# Altium schematic sheet iSystem-battery_charger.SchDoc
size 420 x 297 mm; SheetNumber: 2; SheetTotal: 8
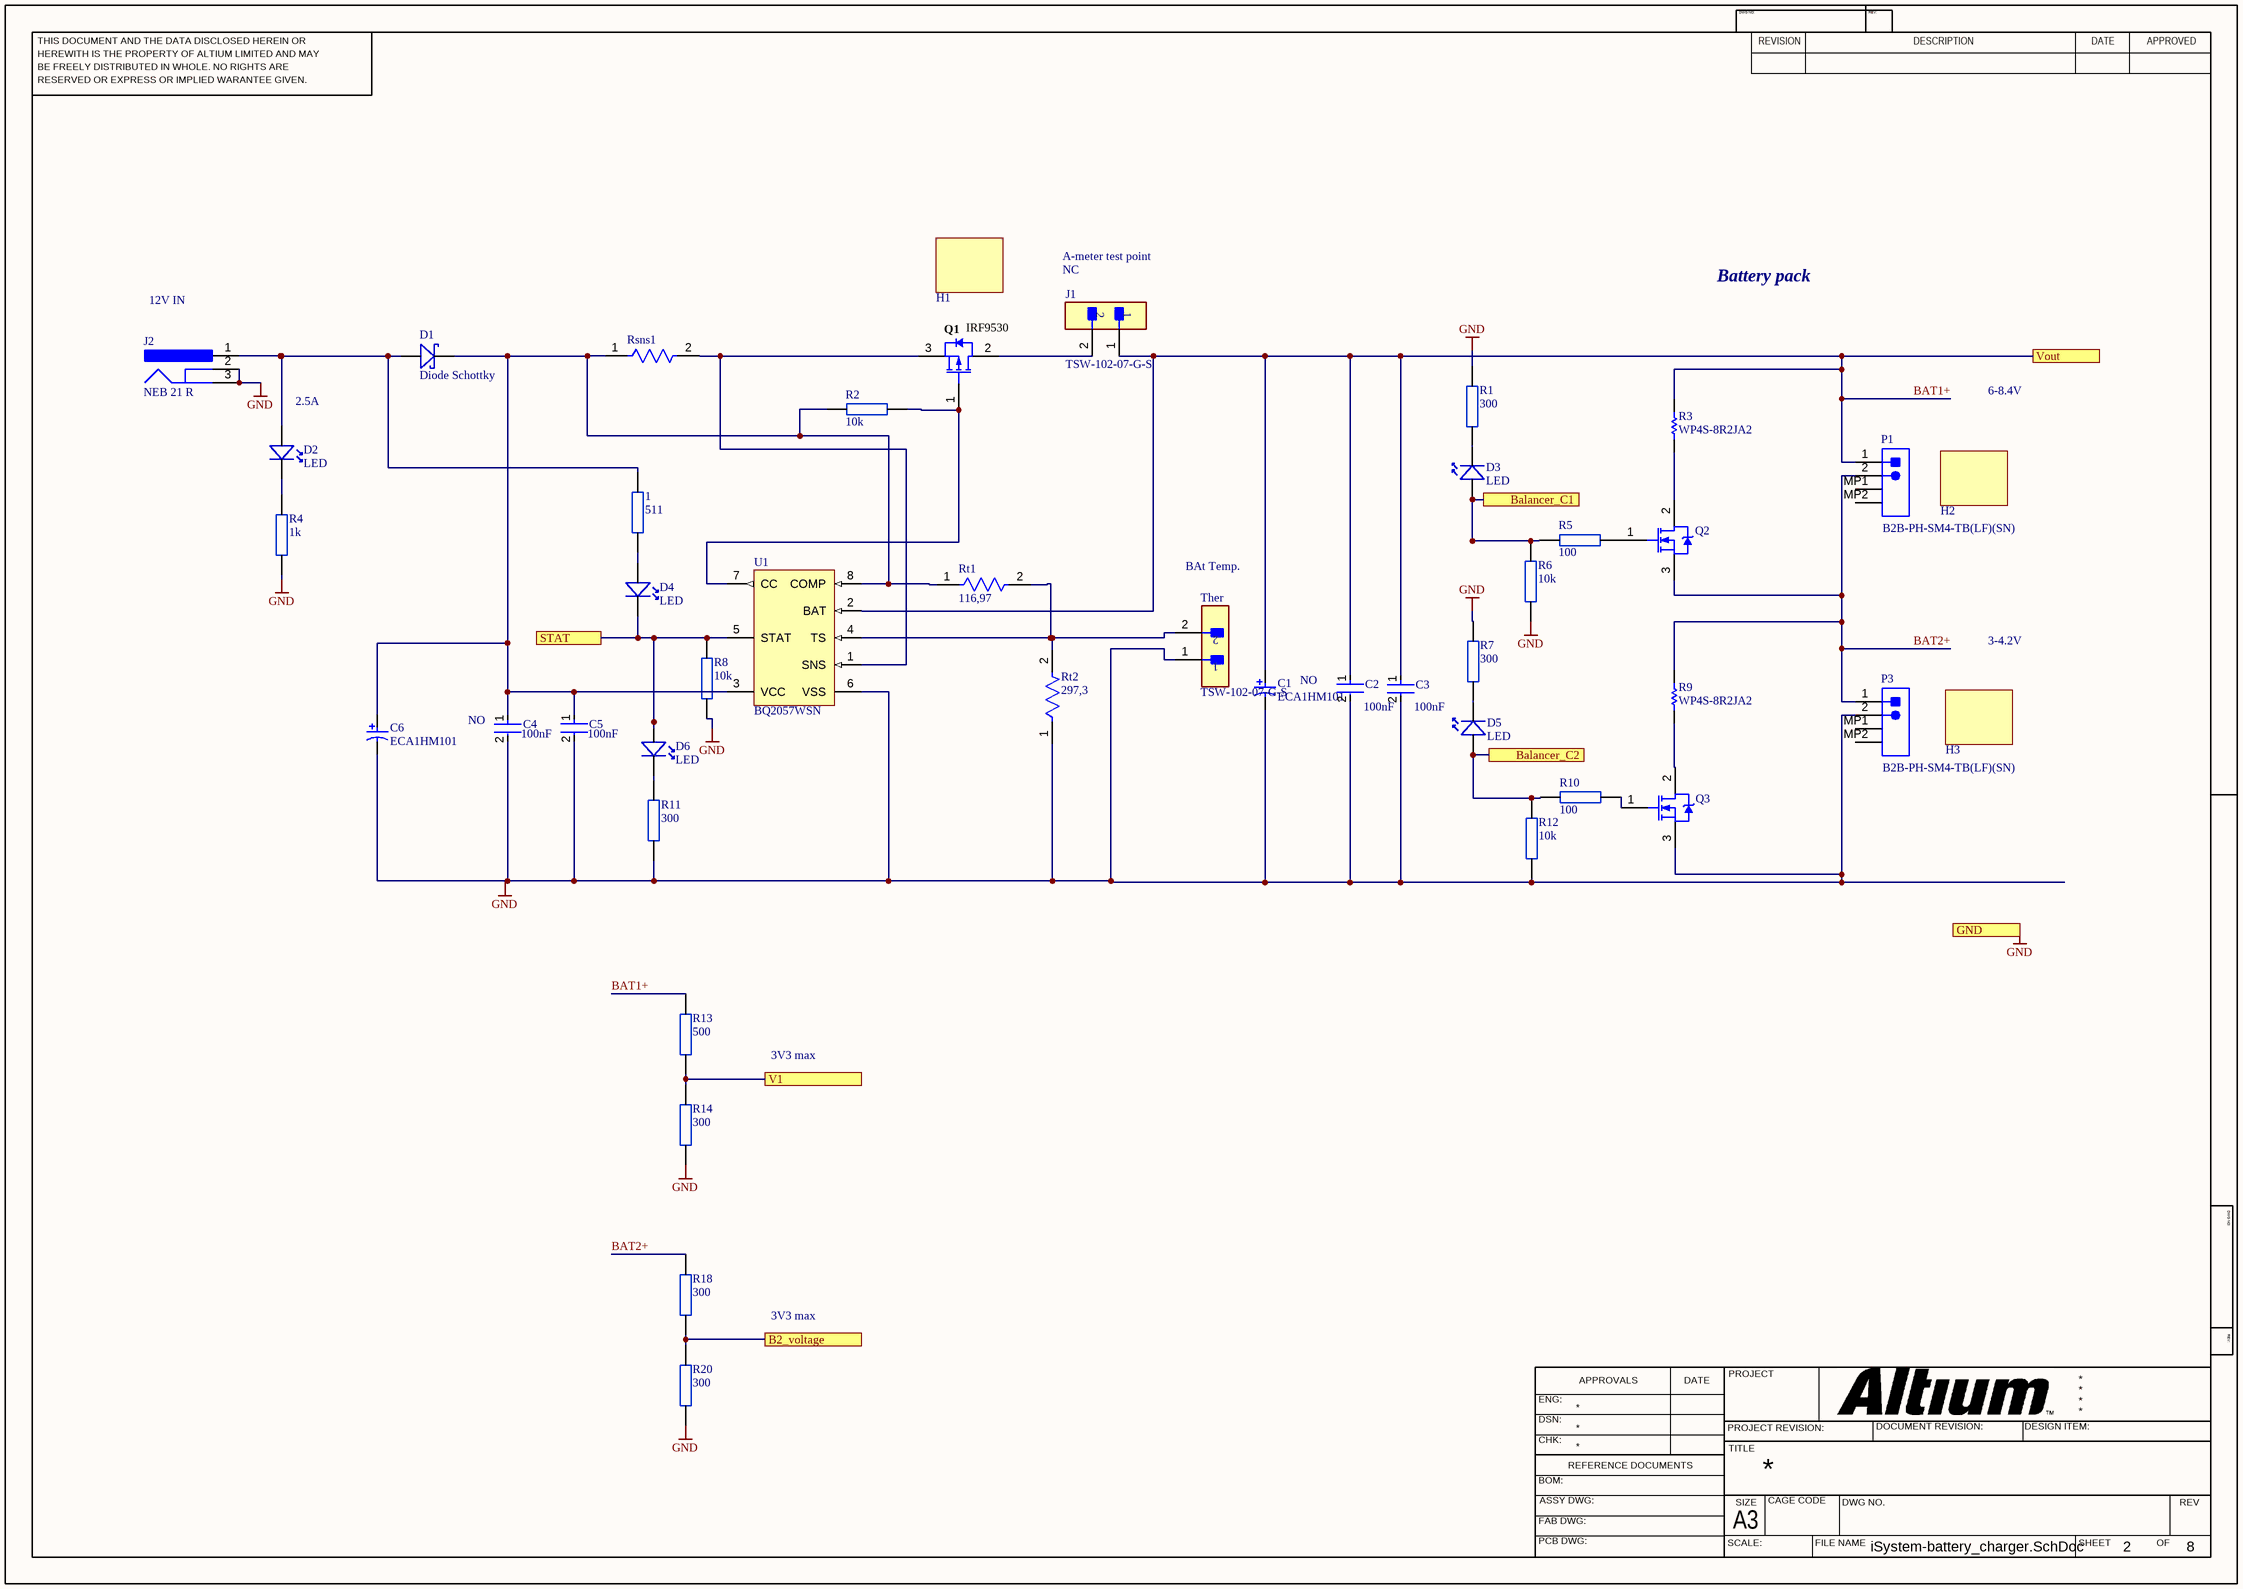
[diagram p0: iSystem-battery_charger.SchDoc]

## Parts
1  511  [0603]
C1  ECA1HM101  [CAPPR65-350-1150X800X1250]
C2  100nF  [FP-CGA3E-0_3-0_1-IPC_A]
C3  100nF  [FP-CGA3E-0_3-0_1-IPC_A]
C4  100nF  [FP-CGA3E-0_3-0_1-IPC_A]
C5  100nF  [FP-CGA3E-0_3-0_1-IPC_A]
C6  ECA1HM101  [CAPPR65-350-1150X800X1250]
D1  Diode Schottky  [DO-214AC SMA]
D2  LED  [0805 LED RED]
D3  LED  [0805 LED RED]
D4  LED  [0805 LED RED]
D5  LED  [0805 LED RED]
D6  LED  [0805 LED RED]
H1  TO-220AB heatsink  [TO-220AB heatsink]  (value not drawn)
H2  TO-220AB heatsink  [TO-220AB heatsink]  (value not drawn)
H3  TO-220AB heatsink  [TO-220AB heatsink]  (value not drawn)
J1  TSW-102-07-G-S  [FP-TSW-102-07-G-S-MFG]
J2  NEB 21 R  [LUMB-NEB21R_V]
P1  B2B-PH-SM4-TB(LF)(SN)  [JST-B2B-PH-SM4-TB-2_V]
P3  B2B-PH-SM4-TB(LF)(SN)  [JST-B2B-PH-SM4-TB-2_V]
Q1  IRF9530  [FAIR-TO-220-3]
Q2  IRFB31N20DPBF  [INTR-TO-220AB-3]  (value not drawn)
Q3  IRFB31N20DPBF  [INTR-TO-220AB-3]  (value not drawn)
R1  300  [0603]
R2  10k  [0603]
R3  WP4S-8R2JA2  [VISH-A1-2_V2]
R4  1k  [0603]
R5  100  [0603]
R6  10k  [0603]
R7  300  [0603]
R8  10k  [0603]
R9  WP4S-8R2JA2  [VISH-A1-2_V2]
R10  100  [0603]
R11  300  [0603]
R12  10k  [0603]
R13  500  [0603]
R14  300  [0603]
R18  300  [0603]
R20  300  [0603]
Rsns1  CRCW12060000Z0EA  [FP-CRCW1206-e3-IPC_C]  (value not drawn)
Rt1  116,97  [FP-CRCW1206-e3-IPC_C]
Rt2  297,3  [FP-CRCW1206-e3-IPC_C]
Ther  TSW-102-07-G-S  [FP-TSW-102-07-G-S-MFG]
U1  BQ2057WSN  [D0008A_N]

## Ports
B2_voltage, Balancer_C1, Balancer_C2, GND, STAT, V1, Vout

## Nets
GND: C1.2 C2.2 C3.2 C4.2 C5.2 C6.2 J2.2 J2.3 P3.2 Q3.3(S) R1.1 R4.1 R6.2 R7.1 R8.1 R11.1 R12.2 R14.1 R20.1 Rt2.1 Ther.1 U1.6(VSS) ; port GND
B2_voltage: R18.1 R20.2 ; port B2_voltage
Balancer_C1: D3.1(A) R5.2 R6.1 ; port Balancer_C1
Balancer_C2: D5.1(A) R10.2 R12.1 ; port Balancer_C2
BAT1+: C1.1 C2.1 C3.1 J1.1 P1.1 R3.2 R13.2 U1.2(BAT) ; port Vout
BAT2+: P1.2 P3.1 Q2.3(S) R9.2 R18.2
STAT: D4.2(K) D6.1(A) R8.2 U1.5(STAT) ; port STAT
V1: R13.1 R14.2 ; port V1
Net1_1: 1.1 D4.1(A)
Net1_2: 1.2 D1.1(A) D2.1(A) J2.1
NetC4_1: C4.1 C5.1 C6.1 D1.2(K) R2.2 Rsns1.1 Rt1.1 U1.3(VCC) U1.8(COMP)
NetD2_2: D2.2(K) R4.2
NetD3_2: D3.2(K) R1.2
NetD5_2: D5.2(K) R7.2
NetD6_2: D6.2(K) R11.2
NetJ1_2: J1.2 Q1.2(D)
NetQ1_1: Q1.1(G) R2.1 U1.7(CC)
NetQ1_3: Q1.3(S) Rsns1.2 U1.1(SNS)
NetQ2_1: Q2.1(G) R5.1
NetQ2_2: Q2.2(D) R3.1
NetQ3_1: Q3.1(G) R10.1
NetQ3_2: Q3.2(D) R9.1
NetRt1_2: Rt1.2 Rt2.2 Ther.2 U1.4(TS)

Not connected (* = marked no-connect by the designer): P1 MP1 MP2; P3 MP1 MP2

## Notes on the sheet
- A-meter test point
- 12V IN
- NC
- Battery pack
- 6-8.4V
- (near D2) 2.5A
- BAt Temp.
- 3-4.2V
- (near C4) NO
- NO
- 3V3 max
- THIS DOCUMENT AND THE DATA DISCLOSED HEREIN OR
- HEREWITH IS THE PROPERTY OF ALTIUM LIMITED AND MAY
- DWG NO:
- REVISION
- REV:
- DESCRIPTION
- DATE
- APPROVED
- BE FREELY DISTRIBUTED IN WHOLE. NO RIGHTS ARE
- RESERVED OR EXPRESS OR IMPLIED WARANTEE GIVEN.
- ENG:
- APPROVALS
- PROJECT
- DSN:
- CHK:
- REFERENCE DOCUMENTS
- PROJECT REVISION:
- TITLE
- DOCUMENT REVISION:
- DESIGN ITEM:
- BOM:
- FAB DWG:
- PCB DWG:
- ASSY DWG:
- SCALE:
- A3
- SIZE
- CAGE CODE
- FILE NAME
- DWG NO.
- SHEET
- OF
- REV

## Library data of the parts
1 R1 R2 R4-R8 R10-R14 R18 R20 = Resistor: Value: ?
C1 C6 = CMP-1665-00042-2: Aluminum Electrolytic Capacitor, 100 uF, +/- 20%, 50 V, -40 to 85 degC, 2-Pin THD, RoHS, Bulk; Manufacturer: Panasonic; Lead Diameter: 0.6mm; Dielectric Material: Aluminium; Voltage Rating (DC): 50V; Ripple Current (AC): 250mA; Polarity: Polar; Leakage Current: 3uA; Capacitance: 100uF; Life (Hours): 2000Hour; Lead/Base Style: Straight; Dissipation Factor: 0.12%; Radiation Hardening: No; Height: 11.5mm; Package Quantity: 200; Package Reference: CAPPR65-350-1150X800X1250; Min Operating Temperature: -40degC; Mount: ThroughHole; Package Description: 2-Pin Radial Lead, Dia 8 mm, Height 12.5 mm; Case/Package: Radial; Diameter: 8mm; Voltage Rating: 50V; Length: 11.5mm; REACH SVHC: NoSVHC; Height - Seated (Max): 0.492inch; Datasheet URL: https://industrial.panasonic.com/cdbs/www-data/pdf/RDF0000/ABA0000C1218.pdf; RoHSCompliant: true; Ripple Current: 250mA; Lead Free: LeadFree; Voltage: 50V; Manufacturer URL: http://www.panasonic.com/; Number of Pins: 2; Datasheet Version: Rev. 05, 10/2016; Packaging: Bulk; Termination: Radial; Max Operating Temperature: 85degC; Tolerance: 20%; Lead Pitch: 3.5mm
C2-C5 = CMP-2000-07546-2: Cap Ceramic 100nF 50V X7R 10% Pad SMD 0603 +125°C Automotive T/R; Weight: 7.1E-05oz; Composition: Ceramic; Max Operating Temperature: 125°C; Termination: SMD/SMT; Dielectric: X7R; Length: 1.6mm; Package Quantity: 1; REACH SVHC: No SVHC; Lead Free: Lead Free; Case Code (Metric): 1608; Min Operating Temperature: -55°C; Packaging: Tape and Reel; Tolerance: 10%; Voltage Rating: 50V; Case Code (Imperial): 0603; Capacitance: 100nF; Case/Package: 0603; Voltage Rating (DC): 50V; Depth: 0.8mm; Radiation Hardening: No; Ratings: AEC-Q200; Mount: Surface Mount; Voltage: 50V; Thickness: 0.035inch; Width: 0.8mm; Height: 0.8mm
J1 Ther = CMP-02766-000084-1: CONN HEADER VERT 2POS 2.54MM; Manufacturer: Samtec; Number Of Contacts: 2; Voltage Rating: 550V; Conn Orientation: Straight; Current Rating: 6.3A; Conn Gender: Male; Package: TSW-102-07-G-S; Digikey Description: CONN HEADER VERT 2POS 2.54MM; ComponentLink2URL: http://suddendocs.samtec.com/catalog_english/tsw_th.pdf; Height: 8.71mm; Temperature: -55°C to +125°C; Device Class L2: Headers and Wire Housings; ComponentLink2Description: Datasheet; Device Class L3: unset; Contact Material: Gold,Nickel; Temperature Range Low: -55°C; Temperature Range High: +125°C; RoHS: TRUE; Device Class L1: Connectors; Mouser Description: Conn Unshrouded Header HDR 2 POS 2.54mm Solder ST Thru-Hole Automotive Bulk; Number Of Rows: 1; Category: Conn; Pitch: 2.54mm; Lead Free: Yes; Automotive: No; Manufacturer Part Number: TSW-102-07-G-S; Footprint Url: http://suddendocs.samtec.com/prints/tsw-xxx-xx-x-x-xx-xxx-footprint.pdf; Octopart: https://octopart.com/tsw-102-07-g-s-samtec-272197
J2 = CMP-2000-06841-1: Jack Socket, Body 14.5 x 9 mm, Height 11 mm, -20 to 70 degC, 3-Pin THD, RoHS, Bulk; Manufacturer: Lumberg; Body Orientation: RightAngle; Voltage Rating: 12Vdc; Current Rating: 3A; Maximum Operating Temperature: +70°C; Mounting Technology: ThroughHole; Termination Method: Solder; Package Description: 3-Pin Through Hole Device, Body 14.5 x 9 mm, Height 11 mm; Datasheet URL: https://datasheet.ciiva.com/11720/0900766b805694d6-11720273.pdf; Datasheet Version: 12/2004; Package Reference: NEB21R; Manufacturer URL: http://www.lumberg.com/; Plug/Socket: Socket; Mounting Type: ThroughHole; Minimum Operating Temperature: -20°C
P1 P3 = CMP-2000-05163-1: Male Header, Pitch 2 mm, 1 x 2 Position, Height 6.6 mm, RoHS, Tape and Reel; Manufacturer: JST; No of Positions: 2; Style/Orientation: StraightHeader/Plug; Pitch: 2mm; Datasheet URL: https://ciiva.com/datasheet-click-26894756?src=ciiva&sig=90099765; Termination: Crimp; Manufacturer URL: http://www.jst.com/home2.html; Type: ShroudedHeader; Datasheet Version: Dec-12
Q1 = CMP-2000-04936-1: P-Channel QFET(R) MOSFET, -60 V, -27 A, -55 to 175 degC, 3-Pin TO-220, RoHS, Tube; Manufacturer: Fairchild; Rated Power Dissipation: 120W; Qg Gate Charge: 33nC; Drain-Source On Resistance-Max: 0.07O; Drain-to-Source Voltage [Vdss]: 60V; Package Reference: TO-220; Datasheet URL: https://www.fairchildsemi.com/datasheets/FQ/FQP27P06.pdf; Datasheet Version: Mar-13; Package Description: 3-Pin Through Hole Device, Body 10 x 4.5 mm, Pitch 2.54 mm; Package URL: https://www.fairchildsemi.com/package-drawings/TO/TO220B03.pdf; Channel Type: P-Channel; Manufacturer URL: https://www.fairchildsemi.com/
Q2 Q3 = CMP-2000-06468-1: HEXFET(R) Power MOSFET, 200 V, 31 A, 82 mOhm, -55 to 175 degC, 3-Pin FM (TO-220AB), RoHS, Tube; Manufacturer: International Rectifier; Temperature, Operating, Maximum: +175°C; Channel Mode: Enhancement; Power Dissipation: 200W; Time, Turn-Off Delay: 26ns; Voltage, Gate to Source: ±30V; Capacitance, Input: 2370pF@25V; Gate Charge, Total: 70nC; Brand/Series: HEXFET®Series; Voltage, Diode Forward: 1.3V; Polarization: N-Channel; Transconductance, Forward: 17S; Resistance, Thermal, Junction to Case: 0.75°C/W; Current, Drain: 31A; Time, Turn-On Delay: 16ns; Configuration: DualDrain; Resistance, Drain to Source On: 0.082Ω; Channel Type: N; Temperature, Operating, Minimum: -55°C; Number of Elements per Chip: 1; Temperature, Operating, Range: -55to+175°C; Voltage, Drain to Source: 200V; Typical Gate Charge @ Vgs: 70nC@10V; Package Description: 3-Pin Flange Mount, Body 4.445 x 10.415 mm, Pitch 2.54 mm; Length: 10.54mm; Mounting Technology: ThroughHole; Height: 8.77mm; Width: 4.69mm; Datasheet Version: 01/2004; Mounting Type: ThroughHole; Voltage, Forward, Diode: 1.3V; Datasheet URL: http://www.infineon.com/dgdl/irfb31n20dpbf.pdf?fileId=5546d462533600a40153561547951df1; Package Type: TO-220AB; Number of Pins: 3; Package Reference: TO-220AB; Dimensions: 10.54x4.69x8.77mm; Manufacturer URL: http://internationalrectifier.com/; Voltage, Breakdown, Drain to Source: 200V
R3 R9 = CMP-1240-00001-1: Power Metal Film Leaded Resistor, 62 KOhm +/-5%, 2 W, 2-Pin THD, RoHS, Ammo Pack; PartNumber: PR02000206202JA100; Manufacturer: Vishay Semiconductor; Resistance: 62 KOhm; Temperature Coefficient: +/-250 ppm/degC; Power: 2 W; ComponentLink2URL: http://www.vishay.com/docs/28729/28729.pdf; Mounting Technology: Through Hole; Tolerance: +/-5%; ComponentLink3Description: Package Specification; ComponentLink3URL: http://www.vishay.com/docs/28729/28729.pdf; ComponentLink1Description: Manufacturer URL; ComponentLink2Description: Datasheet; DatasheetVersion: Jun-13; PackageDescription: 2-Pin Axial Lead, Body 10 x 3.9 mm; ComponentLink1URL: http://www.vishay.com/; Packing: Ammo Pack; RoHS: TRUE
Rsns1 Rt1 Rt2 = CMP-2003-04857-2: RES Thick Film, 0Ω, 0.25W, 1206; Resistance: 0mR; Power Rating: 250mW; Temperature Coefficient: 100ppm/°C; Tolerance: 1%; Voltage Rating (DC): 200V; Width: 1.6mm; Termination: SMD/SMT; Contact Plating: Tin; Min Operating Temperature: -55°C; Military Standard: Not; Mount: Surface Mount; Case Code (Metric): 3216; Case Code (Imperial): 1206; Packaging: Tape and Reel; Depth: 1.6mm; Case/Package: 1206; Radiation Hardening: No; Height: 0.55mm; Package Quantity: 5000; Weight: 0.000353oz; Max Operating Temperature: 155°C; Length: 3.2mm; Composition: Thick Film; Lead Free: Lead Free; Voltage Rating: 200V
U1 = CMP-0321-00344-2: Low Dropout Linear 2-Cell Li-Ion Charge Controller with AutoCompTM, 8.4 V, 4.5 V, -20 to 70 degC, 8-pin SOIC (D), Green (RoHS & no Sb/Br); Manufacturer: Texas Instruments; Over Voltage Protection: N; SubFamily: Battery Charge Management; Vin(Min)(V): 4.5; Li-Polymer: Y; Mounting Technology: Surface Mount; PackageDescription: 8-Pin Plastic Small Outline Integrated Circuit, 4.9 x 3.9 mm, Pitch 1.27 mm Pitch; NiCd: N; ComponentLink1Description: Datasheet; PackageVersion: revM, Jun-2011; Eco-Plan: Green (RoHS & no Sb/Br); ComponentLink1URL: http://www.ti.com/general/docs/lit/getliterature.tsp?genericPartNumber=BQ2057W&fileType=pdf; NiMH: N; Code_JEDEC: MS-012AA; Lead Acid: N; PackageReference: D0008A; PartNumber: BQ2057WSN; Li-Ion: Y; DatasheetVersion: SLUS025F